# Altium schematic sheet Sheet_1_2022-04-26.schdoc
size 615 x 424 mm
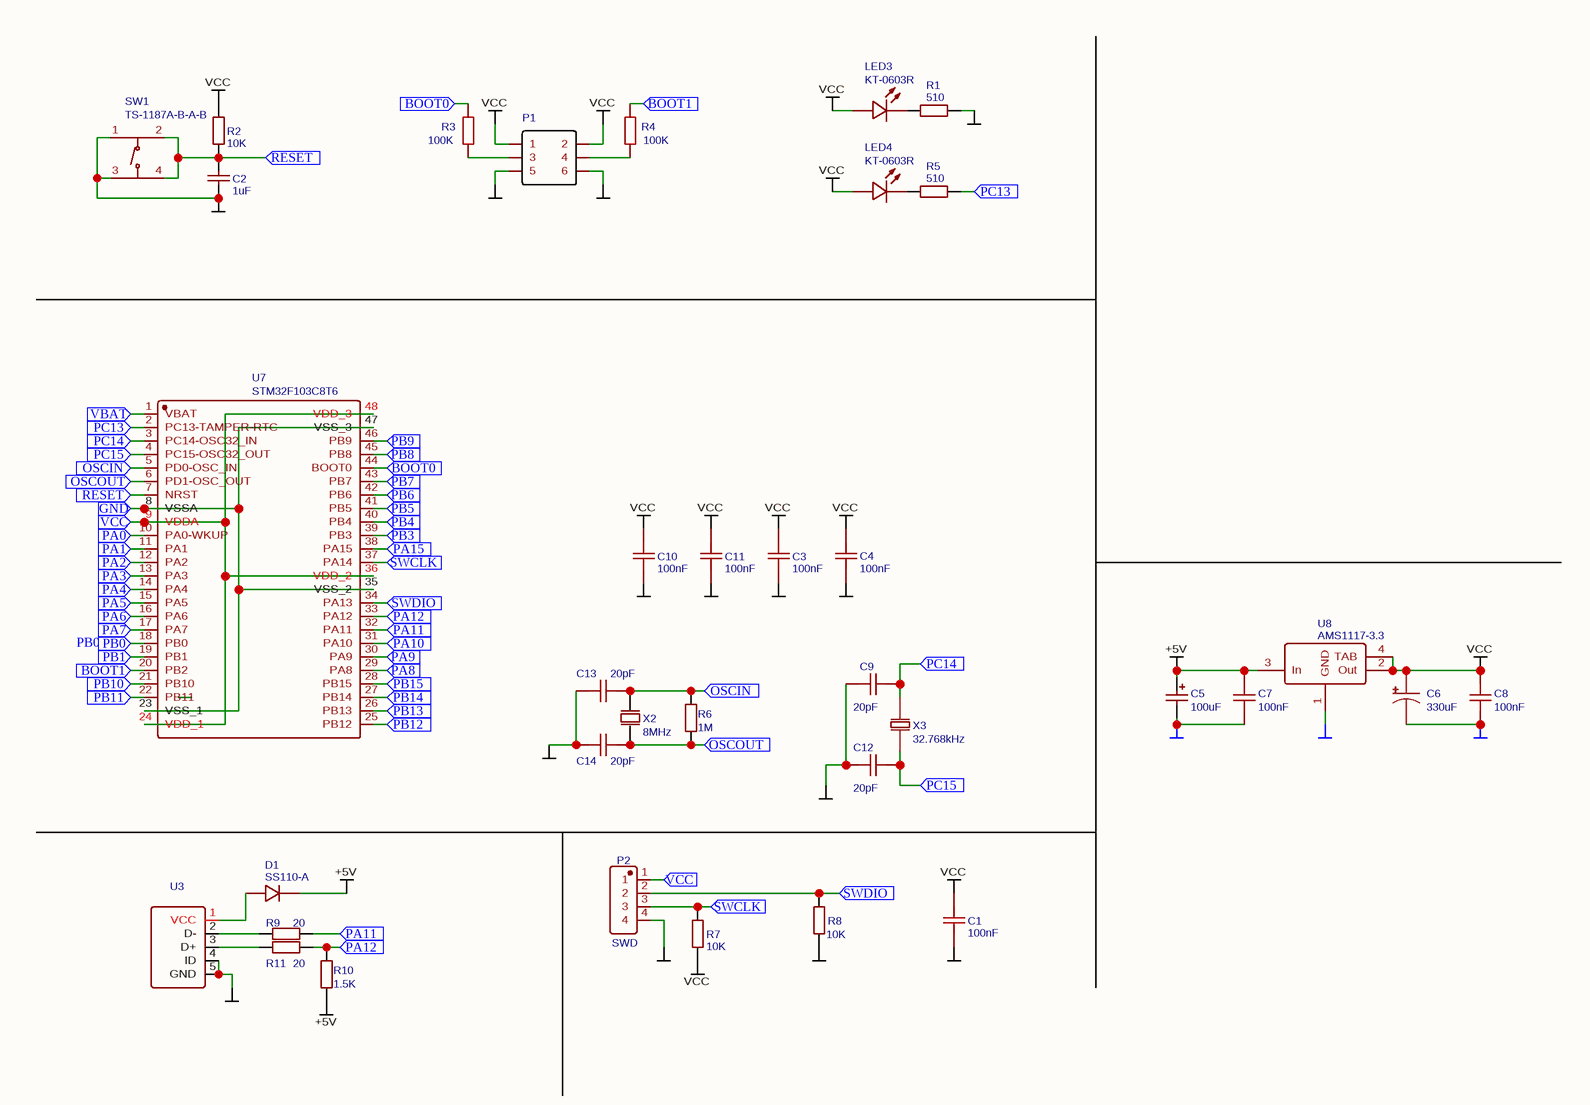
[diagram p0: Sheet_1_2022-04-26.schdoc, top left]
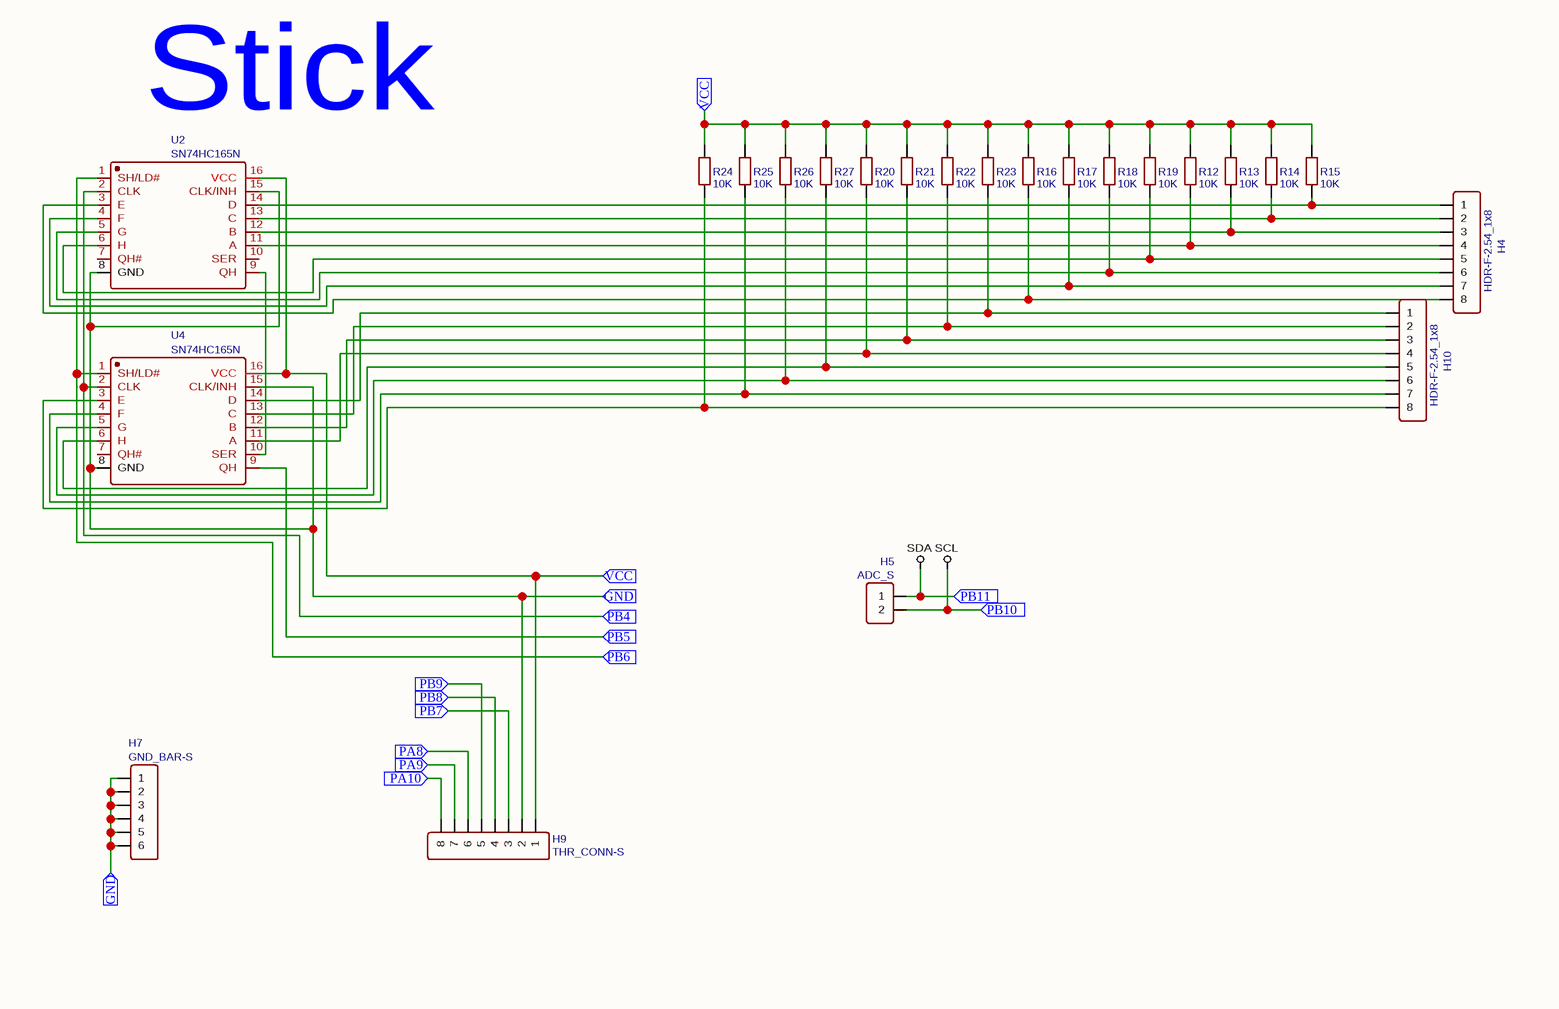
[diagram p1: Sheet_1_2022-04-26.schdoc, top right]
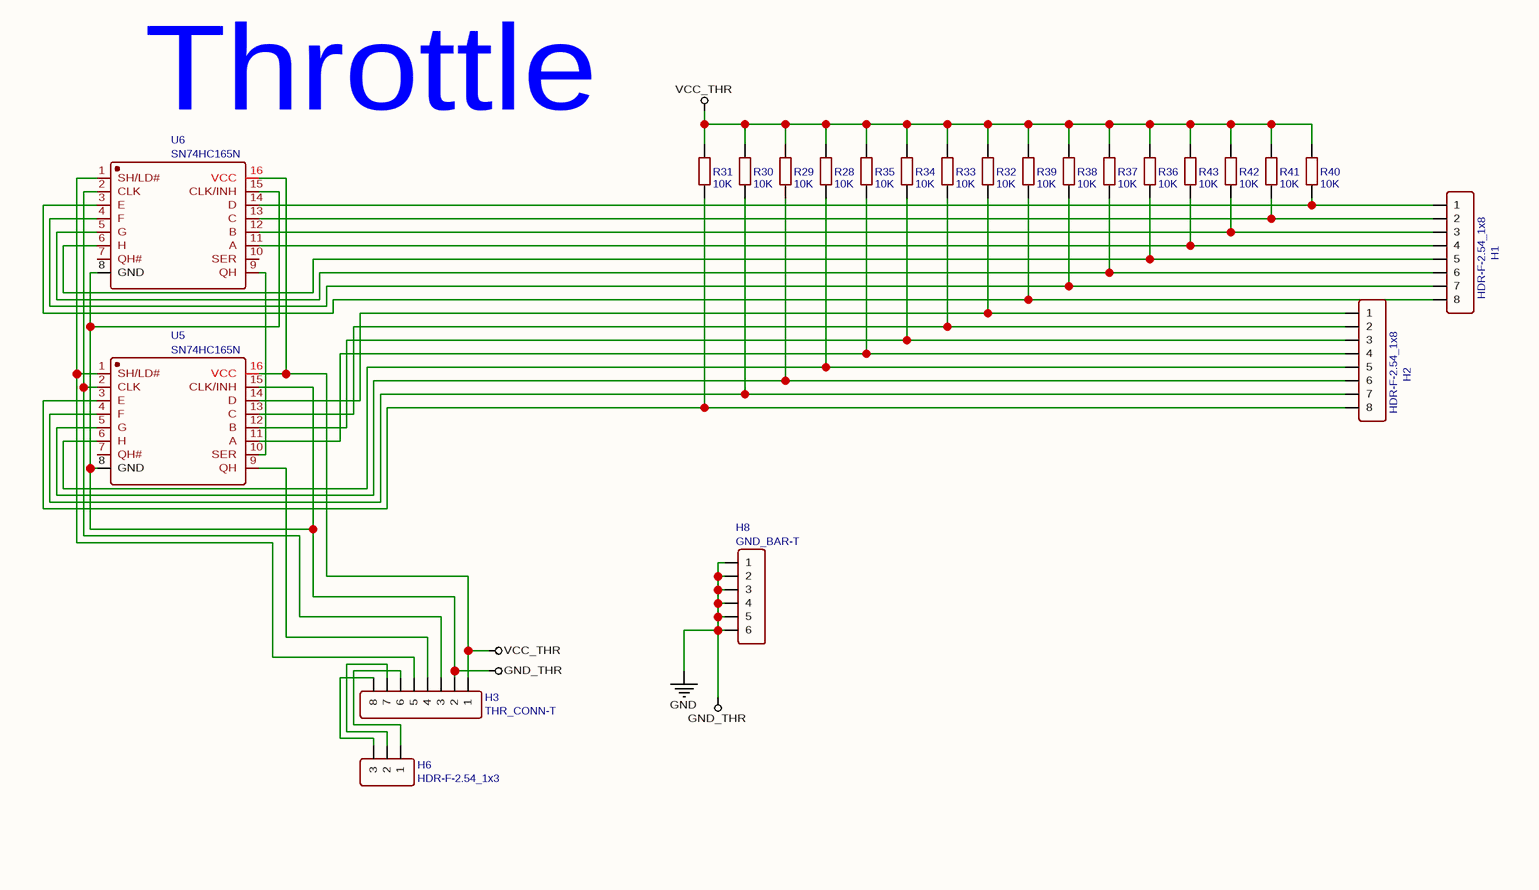
[diagram p2: Sheet_1_2022-04-26.schdoc, bottom right]

## Parts
C1  100nF  [0603_1608METRIC_PAD1.05X0.95MM_HANDSOLDER]
C2  1uF  [0603_1608METRIC_PAD1.05X0.95MM_HANDSOLDER]
C3  100nF  [0603_1608METRIC_PAD1.05X0.95MM_HANDSOLDER]
C4  100nF  [0603_1608METRIC_PAD1.05X0.95MM_HANDSOLDER]
C5  100uF  [CASE-C_6032]
C6  330uF  [CASE-C_6032]
C7  100nF  [0603_1608METRIC_PAD1.05X0.95MM_HANDSOLDER]
C8  100nF  [0603_1608METRIC_PAD1.05X0.95MM_HANDSOLDER]
C9  20pF  [0603_1608METRIC_PAD1.05X0.95MM_HANDSOLDER]
C10  100nF  [0603_1608METRIC_PAD1.05X0.95MM_HANDSOLDER]
C11  100nF  [0603_1608METRIC_PAD1.05X0.95MM_HANDSOLDER]
C12  20pF  [0603_1608METRIC_PAD1.05X0.95MM_HANDSOLDER]
C13  20pF  [0603_1608METRIC_PAD1.05X0.95MM_HANDSOLDER]
C14  20pF  [0603_1608METRIC_PAD1.05X0.95MM_HANDSOLDER]
D1  SS110-A  [SMA(DO-214AC)]
H1  HDR-F-2.54_1x8  [HDR-F-2.54_1X8]
H2  HDR-F-2.54_1x8  [HDR-F-2.54_1X8]
H3  THR_CONN-T  [HDR-F-2.54_1X8]
H4  HDR-F-2.54_1x8  [HDR-F-2.54_1X8]
H5  ADC_S  [HDR-F-2.54_1X2]
H6  HDR-F-2.54_1x3  [HDR-F-2.54_1X3]
H7  GND_BAR-S  [HDR-F-2.54_1X6]
H8  GND_BAR-T  [HDR-F-2.54_1X6]
H9  THR_CONN-S  [HDR-F-2.54_1X8]
H10  HDR-F-2.54_1x8  [HDR-F-2.54_1X8]
LED3  KT-0603R  [LED0603-R-RD]
LED4  KT-0603R  [LED0603-R-RD]
P1  HDR-IDC-2.54-2X3P  [HEADER-2.54-P2×3]  (value not drawn)
P2  SWD  [HEADER-2.54-P4-ANG]
R1  510  [0603_1608METRIC_PAD1.05X0.95MM_HANDSOLDER]
R2  10K  [0603_1608METRIC_PAD1.05X0.95MM_HANDSOLDER]
R3  100K  [0603_1608METRIC_PAD1.05X0.95MM_HANDSOLDER]
R4  100K  [0603_1608METRIC_PAD1.05X0.95MM_HANDSOLDER]
R5  510  [0603_1608METRIC_PAD1.05X0.95MM_HANDSOLDER]
R6  1M  [0603_1608METRIC_PAD1.05X0.95MM_HANDSOLDER]
R7  10K  [0603_1608METRIC_PAD1.05X0.95MM_HANDSOLDER]
R8  10K  [0603_1608METRIC_PAD1.05X0.95MM_HANDSOLDER]
R9  20  [0603_1608METRIC_PAD1.05X0.95MM_HANDSOLDER]
R10  1.5K  [0603_1608METRIC_PAD1.05X0.95MM_HANDSOLDER]
R11  20  [0603_1608METRIC_PAD1.05X0.95MM_HANDSOLDER]
R12  10K  [0603_1608METRIC_PAD1.05X0.95MM_HANDSOLDER]
R13  10K  [0603_1608METRIC_PAD1.05X0.95MM_HANDSOLDER]
R14  10K  [0603_1608METRIC_PAD1.05X0.95MM_HANDSOLDER]
R15  10K  [0603_1608METRIC_PAD1.05X0.95MM_HANDSOLDER]
R16  10K  [0603_1608METRIC_PAD1.05X0.95MM_HANDSOLDER]
R17  10K  [0603_1608METRIC_PAD1.05X0.95MM_HANDSOLDER]
R18  10K  [0603_1608METRIC_PAD1.05X0.95MM_HANDSOLDER]
R19  10K  [0603_1608METRIC_PAD1.05X0.95MM_HANDSOLDER]
R20  10K  [0603_1608METRIC_PAD1.05X0.95MM_HANDSOLDER]
R21  10K  [0603_1608METRIC_PAD1.05X0.95MM_HANDSOLDER]
R22  10K  [0603_1608METRIC_PAD1.05X0.95MM_HANDSOLDER]
R23  10K  [0603_1608METRIC_PAD1.05X0.95MM_HANDSOLDER]
R24  10K  [0603_1608METRIC_PAD1.05X0.95MM_HANDSOLDER]
R25  10K  [0603_1608METRIC_PAD1.05X0.95MM_HANDSOLDER]
R26  10K  [0603_1608METRIC_PAD1.05X0.95MM_HANDSOLDER]
R27  10K  [0603_1608METRIC_PAD1.05X0.95MM_HANDSOLDER]
R28  10K  [0603_1608METRIC_PAD1.05X0.95MM_HANDSOLDER]
R29  10K  [0603_1608METRIC_PAD1.05X0.95MM_HANDSOLDER]
R30  10K  [0603_1608METRIC_PAD1.05X0.95MM_HANDSOLDER]
R31  10K  [0603_1608METRIC_PAD1.05X0.95MM_HANDSOLDER]
R32  10K  [0603_1608METRIC_PAD1.05X0.95MM_HANDSOLDER]
R33  10K  [0603_1608METRIC_PAD1.05X0.95MM_HANDSOLDER]
R34  10K  [0603_1608METRIC_PAD1.05X0.95MM_HANDSOLDER]
R35  10K  [0603_1608METRIC_PAD1.05X0.95MM_HANDSOLDER]
R36  10K  [0603_1608METRIC_PAD1.05X0.95MM_HANDSOLDER]
R37  10K  [0603_1608METRIC_PAD1.05X0.95MM_HANDSOLDER]
R38  10K  [0603_1608METRIC_PAD1.05X0.95MM_HANDSOLDER]
R39  10K  [0603_1608METRIC_PAD1.05X0.95MM_HANDSOLDER]
R40  10K  [0603_1608METRIC_PAD1.05X0.95MM_HANDSOLDER]
R41  10K  [0603_1608METRIC_PAD1.05X0.95MM_HANDSOLDER]
R42  10K  [0603_1608METRIC_PAD1.05X0.95MM_HANDSOLDER]
R43  10K  [0603_1608METRIC_PAD1.05X0.95MM_HANDSOLDER]
SW1  TS-1187A-B-A-B  [SW-SMD_4P-L5.1-W5.1-P3.70-LS6.5-TL-2]
U2  SN74HC165N  [DIP-16_L19.8-W6.5-P2.54-LS7.6-BL]
U3  Micro USB-B 5P_C40942  [USB-MICROB]  (value not drawn)
U4  SN74HC165N  [DIP-16_L19.8-W6.5-P2.54-LS7.6-BL]
U5  SN74HC165N  [DIP-16_L19.8-W6.5-P2.54-LS7.6-BL]
U6  SN74HC165N  [DIP-16_L19.8-W6.5-P2.54-LS7.6-BL]
U7  STM32F103C8T6  [LQFP-48_L7.0-W7.0-P0.50-LS9.0-BL]
U8  AMS1117-3.3  [SOT-223]
X2  8MHz  [CRYSTAL-SMD_L11.5-W4.8-LS12.7]
X3  32.768kHz  [FC-135R_L3.2-W1.5]

## Ports
BOOT0 (in), BOOT1 (in), GND (in), OSCIN (in), OSCOUT (in), PA0 (in), PA1 (in), PA2 (in), PA3 (in), PA4 (in), PA5 (in), PA6 (in), PA7 (in), PA8 (in), PA9 (in), PA10 (in), PA11 (in), PA12 (in), PA15 (in), PB0 (in), PB1 (in), PB3 (in), PB4 (in), PB5 (in), PB6 (in), PB7 (in), PB8 (in), PB9 (in), PB10 (in), PB11 (in), PB12 (in), PB13 (in), PB14 (in), PB15 (in), PC13 (in), PC14 (in), PC15 (in), RESET (in), SWCLK (in), SWDIO (in), VBAT (in), VCC (in)

## Nets
+5V: C5.1 C7.2 D1.2 R10.2 U8.3(In)
GND: C1.1 C2.1 C3.1 C4.1 C5.2 C6.2 C7.1 C8.1 C9.1 C10.1 C11.1 C12.1 C13.1 C14.1 H3.2 H8.1 H8.2 H8.3 H8.4 H8.5 H8.6 P1.5 P1.6 P2.4 R1.2 R8.1 SW1.1(A) SW1.3(C) U3.4(ID) U3.5(GND) U5.8(GND) U5.15(CLK/INH) U6.8(GND) U6.15(CLK/INH) U8.1(GND)  [also labelled GND_THR]
SCL: H5.2 U7.21(PB10) ; port PB10
SDA: H5.1 U7.22(PB11) ; port PB11
VCC: C1.2 C3.2 C4.2 C6.1 C8.2 C10.2 C11.2 LED3.1(A) LED4.1(A) P1.1 P1.2 R2.2 R7.1 U8.2(Out) U8.4(TAB)
VCC_THR: H3.1 R28.2 R29.2 R30.2 R31.2 R32.2 R33.2 R34.2 R35.2 R36.2 R37.2 R38.2 R39.2 R40.2 R41.2 R42.2 R43.2 U5.16(VCC) U6.16(VCC)
BOOT0: R3.1 U7.44(BOOT0) ; port BOOT0
BOOT1: R4.1 U7.20(PB2) ; port BOOT1
GND: H7.1 H7.2 H7.3 H7.4 H7.5 H7.6 H9.2 U2.8(GND) U2.15(CLK/INH) U4.8(GND) U4.15(CLK/INH) U7.8(VSSA) U7.23(VSS_1) U7.35(VSS_2) U7.47(VSS_3) ; port GND  [a separate net that carries the same name]
OSCIN: C13.2 R6.2 U7.5(PD0-OSC_IN) X2.1(OSC1) ; port OSCIN
OSCOUT: C14.2 R6.1 U7.6(PD1-OSC_OUT) X2.2(OSC2) ; port OSCOUT
PA0: U7.10(PA0-WKUP) ; port PA0
PA1: U7.11(PA1) ; port PA1
PA2: U7.12(PA2) ; port PA2
PA3: U7.13(PA3) ; port PA3
PA4: U7.14(PA4) ; port PA4
PA5: U7.15(PA5) ; port PA5
PA6: U7.16(PA6) ; port PA6
PA7: U7.17(PA7) ; port PA7
PA8: H9.6 U7.29(PA8) ; port PA8
PA9: H9.7 U7.30(PA9) ; port PA9
PA10: H9.8 U7.31(PA10) ; port PA10
PA11: R9.2 U7.32(PA11) ; port PA11
PA12: R10.1 R11.2 U7.33(PA12) ; port PA12
PA15: U7.38(PA15) ; port PA15
PB0: U7.18(PB0) ; port PB0
PB1: U7.19(PB1) ; port PB1
PB3: U7.39(PB3) ; port PB3
PB4: U2.2(CLK) U4.2(CLK) U7.40(PB4) ; port PB4
PB5: U4.9(QH) U7.41(PB5) ; port PB5
PB6: U2.1(SH/LD#) U4.1(SH/LD#) U7.42(PB6) ; port PB6
PB7: H9.3 U7.43(PB7) ; port PB7
PB8: H9.4 U7.45(PB8) ; port PB8
PB9: H9.5 U7.46(PB9) ; port PB9
PB12: U7.25(PB12) ; port PB12
PB13: U7.26(PB13) ; port PB13
PB14: U7.27(PB14) ; port PB14
PB15: U7.28(PB15) ; port PB15
PC13: R5.2 U7.2(PC13-TAMPER-RTC) ; port PC13
PC14: C9.2 U7.3(PC14-OSC32_IN) X3.2 ; port PC14
PC15: C12.2 U7.4(PC15-OSC32_OUT) X3.1 ; port PC15
RESET: C2.2 R2.1 SW1.2(B) SW1.4(D) U7.7(NRST) ; port RESET
SWCLK: P2.3 R7.2 U7.37(PA14) ; port SWCLK
SWDIO: P2.2 R8.2 U7.34(PA13) ; port SWDIO
VBAT: U7.1(VBAT) ; port VBAT
VCC: H9.1 P2.1 R12.2 R13.2 R14.2 R15.2 R16.2 R17.2 R18.2 R19.2 R20.2 R21.2 R22.2 R23.2 R24.2 R25.2 R26.2 R27.2 U2.16(VCC) U4.16(VCC) U7.9(VDDA) U7.24(VDD_1) U7.36(VDD_2) U7.48(VDD_3) ; port VCC  [a separate net that carries the same name]
NetD1_1: D1.1 U3.1(VCC)
NetH1_1: H1.1 R40.1 U6.14(D)
NetH1_2: H1.2 R41.1 U6.13(C)
NetH1_3: H1.3 R42.1 U6.12(B)
NetH1_4: H1.4 R43.1 U6.11(A)
NetH1_5: H1.5 R36.1 U6.6(H)
NetH1_6: H1.6 R37.1 U6.5(G)
NetH1_7: H1.7 R38.1 U6.4(F)
NetH1_8: H1.8 R39.1 U6.3(E)
NetH2_1: H2.1 R32.1 U5.14(D)
NetH2_2: H2.2 R33.1 U5.13(C)
NetH2_3: H2.3 R34.1 U5.12(B)
NetH2_4: H2.4 R35.1 U5.11(A)
NetH2_5: H2.5 R28.1 U5.6(H)
NetH2_6: H2.6 R29.1 U5.5(G)
NetH2_7: H2.7 R30.1 U5.4(F)
NetH2_8: H2.8 R31.1 U5.3(E)
NetH3_3: H3.3 U5.2(CLK) U6.2(CLK)
NetH3_4: H3.4 U5.9(QH)
NetH3_5: H3.5 U5.1(SH/LD#) U6.1(SH/LD#)
NetH3_6: H3.6 H6.1
NetH3_7: H3.7 H6.2
NetH3_8: H3.8 H6.3
NetH4_1: H4.1 R15.1 U2.14(D)
NetH4_2: H4.2 R14.1 U2.13(C)
NetH4_3: H4.3 R13.1 U2.12(B)
NetH4_4: H4.4 R12.1 U2.11(A)
NetH4_5: H4.5 R19.1 U2.6(H)
NetH4_6: H4.6 R18.1 U2.5(G)
NetH4_7: H4.7 R17.1 U2.4(F)
NetH4_8: H4.8 R16.1 U2.3(E)
NetH10_1: H10.1 R23.1 U4.14(D)
NetH10_2: H10.2 R22.1 U4.13(C)
NetH10_3: H10.3 R21.1 U4.12(B)
NetH10_4: H10.4 R20.1 U4.11(A)
NetH10_5: H10.5 R27.1 U4.6(H)
NetH10_6: H10.6 R26.1 U4.5(G)
NetH10_7: H10.7 R25.1 U4.4(F)
NetH10_8: H10.8 R24.1 U4.3(E)
NetLED3_2: LED3.2(K) R1.1
NetLED4_2: LED4.2(K) R5.1
NetP1_3: P1.3 R3.2
NetP1_4: P1.4 R4.2
NetR9_1: R9.1 U3.2(D-)
NetR11_1: R11.1 U3.3(D+)
NetU2_9: U2.9(QH) U4.10(SER)
NetU5_10: U5.10(SER) U6.9(QH)

Not connected (* = marked no-connect by the designer): U2 7(QH#) 10(SER); U4 7(QH#); U5 7(QH#); U6 7(QH#) 10(SER)

## Notes on the sheet
- (near U2) Stick
- PB0
- (near U6) Throttle

## Library data of the parts
C1 C3 C4 C7 C8 C10 C11 = 100nF: BOM_Manufacturer: SAMSUNG; BOM_Manufacturer Part: CL10B104KA8NNNC; nameAlias: Capacitance; BOM_Supplier: LCSC; BOM_Supplier Part: C1590; spicePre: C; spiceSymbolName: CL10B104KA8NNNC
C2 = 1uF: BOM_Manufacturer Part: CL10A105KO8NNNC; BOM_Manufacturer: SAMSUNG; nameAlias: Capacitance; BOM_Supplier: LCSC; BOM_Supplier Part: C1592; spicePre: C; spiceSymbolName: CL10A105KO8NNNC
C5 = 100uF: BOM_Manufacturer: Xiangyee; BOM_Manufacturer Part: CA45-C016K107T; nameAlias: Capacitance; Contributor: LCSC; BOM_Supplier: LCSC; BOM_Supplier Part: C122646; spicePre: C; spiceSymbolName: CA45-C016K107T
C6 = 330uF: BOM_Manufacturer: Hunan Xiangyee in S&T; BOM_Manufacturer Part: CA45-C6R3K337T; nameAlias: Value; Contributor: LCSC; BOM_Supplier: LCSC; BOM_Supplier Part: C201144; spicePre: C; spiceSymbolName: CA45-C6R3K337T
C9 C12-C14 = 20pF: BOM_Manufacturer: FH; BOM_Manufacturer Part: 0603CG200J500NT; nameAlias: Capacitance; BOM_Supplier: LCSC; BOM_Supplier Part: C91702; spicePre: C; spiceSymbolName: 0603CG200J500NT
D1 = SS110-A: BOM_Manufacturer: FMS; Contributor: LCSC; BOM_Supplier Part: C143192; BOM_Supplier: LCSC; BOM_Manufacturer Part: SS110-A; spicePre: D
H1 H2 H4 H10 = HDR-F-2.54_1x8: Contributor: LCEDA_Lib; BOM_Supplier Part: C225505; BOM_Supplier: LCSC; spicePre: H; spiceSymbolName: HDR-F-2.54_1x8
H3 = THR_CONN-T: Contributor: LCEDA_Lib; BOM_Supplier Part: C225505; BOM_Supplier: LCSC; spicePre: H; spiceSymbolName: HDR-F-2.54_1x8
H5 = ADC_S: Contributor: LCEDA_Lib; BOM_Supplier Part: C49661; BOM_Supplier: LCSC; spicePre: H; spiceSymbolName: HDR-F-2.54_1x2
H6 = HDR-F-2.54_1x3: Contributor: LCEDA_Lib; BOM_Supplier Part: C146690; BOM_Supplier: LCSC; spicePre: H; spiceSymbolName: HDR-F-2.54_1x3
H7 = GND_BAR-S: Contributor: LCEDA_Lib; BOM_Supplier Part: C40877; BOM_Supplier: LCSC; spicePre: H; spiceSymbolName: HDR-F-2.54_1x6
H8 = GND_BAR-T: Contributor: LCEDA_Lib; BOM_Supplier Part: C40877; BOM_Supplier: LCSC; spicePre: H; spiceSymbolName: HDR-F-2.54_1x6
H9 = THR_CONN-S: Contributor: LCEDA_Lib; BOM_Supplier Part: C225505; BOM_Supplier: LCSC; spicePre: H; spiceSymbolName: HDR-F-2.54_1x8
LED3 LED4 = KT-0603R: BOM_Manufacturer: KENTO; BOM_Supplier: LCSC; BOM_Manufacturer Part: KT-0603R; BOM_Supplier Part: C2286; BOM_JLCPCB Part Class: Basic Part; spicePre: L; spiceSymbolName: KT-0603R
P1 = HDR-IDC-2.54-2X3P: BOM_Manufacturer: BOOMELE; BOM_Manufacturer Part: 2X3 2.54mm IDC Box; BOM_Supplier: LCSC; image: //image.lceda.cn/szlcsc/C11214.jpg; BOM_Supplier Part: C11214; spicePre: P
P2 = SWD: BOM_Manufacturer: ZHENGLING; BOM_Manufacturer Part: Z-211-0411-0021-001; Contributor: LCSC; BOM_Supplier: LCSC; BOM_Supplier Part: C152150; spicePre: H
R1 R5 = 510: BOM_Manufacturer: YAGEO; BOM_Manufacturer Part: RC0603FR-07510RL; nameAlias: Resistance (Ohms); BOM_Supplier: LCSC; BOM_Supplier Part: C114670; spicePre: R; spiceSymbolName: RC0603FR-07510RL
R2 R7 R8 R12-R43 = 10K: BOM_Manufacturer: YAGEO; BOM_Manufacturer Part: RC0603JR-0710KL; nameAlias: Resistance (Ohms); BOM_Supplier: LCSC; BOM_Supplier Part: C99198; spicePre: R; spiceSymbolName: RC0603JR-0710KL
R3 R4 = 100K: BOM_Manufacturer: YAGEO; BOM_Manufacturer Part: RC0603FR-07100KL; nameAlias: Resistance (Ohms); Contributor: LCSC; BOM_Supplier: LCSC; BOM_Supplier Part: C14675; spicePre: R; spiceSymbolName: RC0603FR-07100KL
R6 = 1M: BOM_Manufacturer: UniOhm; BOM_Manufacturer Part: 0603WAJ0105T5E; nameAlias: Resistance (Ohms); BOM_Supplier: LCSC; BOM_Supplier Part: C26098; spicePre: R; spiceSymbolName: 0603WAJ0105T5E
R9 R11 = 20: BOM_Manufacturer: FH; BOM_Manufacturer Part: RS-03K20R0FT; nameAlias: Resistance (Ohms); BOM_Supplier: LCSC; BOM_Supplier Part: C136605; spicePre: R; spiceSymbolName: RS-03K20R0FT
R10 = 1.5K: BOM_Manufacturer: UniOhm; BOM_Manufacturer Part: 0603WAJ0152T5E; nameAlias: Resistance (Ohms); BOM_Supplier: LCSC; BOM_Supplier Part: C25989; spicePre: R; spiceSymbolName: 0603WAJ0152T5E
SW1 = TS-1187A-B-A-B: BOM_Manufacturer: XKB Enterprise; Contributor: LCSC; BOM_Supplier: LCSC; BOM_Supplier Part: C318884; BOM_Manufacturer Part: TS-1187A-B-A-B; BOM_JLCPCB Part Class: Basic Part; spicePre: S; spiceSymbolName: TS-1187A-B-A-B
U2 U4-U6 = SN74HC165N: BOM_Manufacturer: TI; spicePre: X; BOM_Supplier: LCSC; BOM_Manufacturer Part: SN74HC165N; BOM_Supplier Part: C2909; BOM_JLCPCB Part Class: Extended Part; spiceSymbolName: SN74HC165N
U3 = Micro USB-B 5P_C40942: BOM_Manufacturer: ValuePro; BOM_Supplier: LCSC; BOM_Manufacturer Part: Micro USB-B 5P_C40942; image: //image.lceda.cn/szlcsc/C40942.jpg; BOM_Supplier Part: C40942; spicePre: U
U7 = STM32F103C8T6: BOM_Manufacturer: STMicroelectronics; timeStamp: 1455028086; BOM_Supplier: LCSC; BOM_Manufacturer Part: STM32F103C8T6; BOM_Supplier Part: C8734; BOM_JLCPCB Part Class: Basic Part; spicePre: U; spiceSymbolName: STM32F103C8T6
U8 = AMS1117-3.3: BOM_Manufacturer: AMS; sourceId: dwIGgezVh; timeStamp: 1476261164; BOM_Supplier Part: C6186; BOM_Supplier: LCSC; BOM_Manufacturer Part: AMS1117-3.3; BOM_LCSC Assembly: Yes; image: //image.lceda.cn/szlcsc/C6186.jpg; spicePre: U
X2 = 8MHz: BOM_Manufacturer: YXC; BOM_Manufacturer Part: X49SM8MSD2SC; nameAlias: Frequency; BOM_Supplier: LCSC; BOM_Supplier Part: C12674; BOM_JLCPCB Part Class: Basic Part; spicePre: X; spiceSymbolName: X49SM8MSD2SC
X3 = 32.768kHz: BOM_Manufacturer Part: Q13FC1350000400; BOM_Manufacturer: EPSON; nameAlias: Frequency; BOM_Supplier: LCSC; BOM_Supplier Part: C32346; BOM_JLCPCB Part Class: Basic Part; spicePre: X; spiceSymbolName: Q13FC1350000400